# EAGLE design 507_outin_dragonboard (EAGLE 7.5.0)
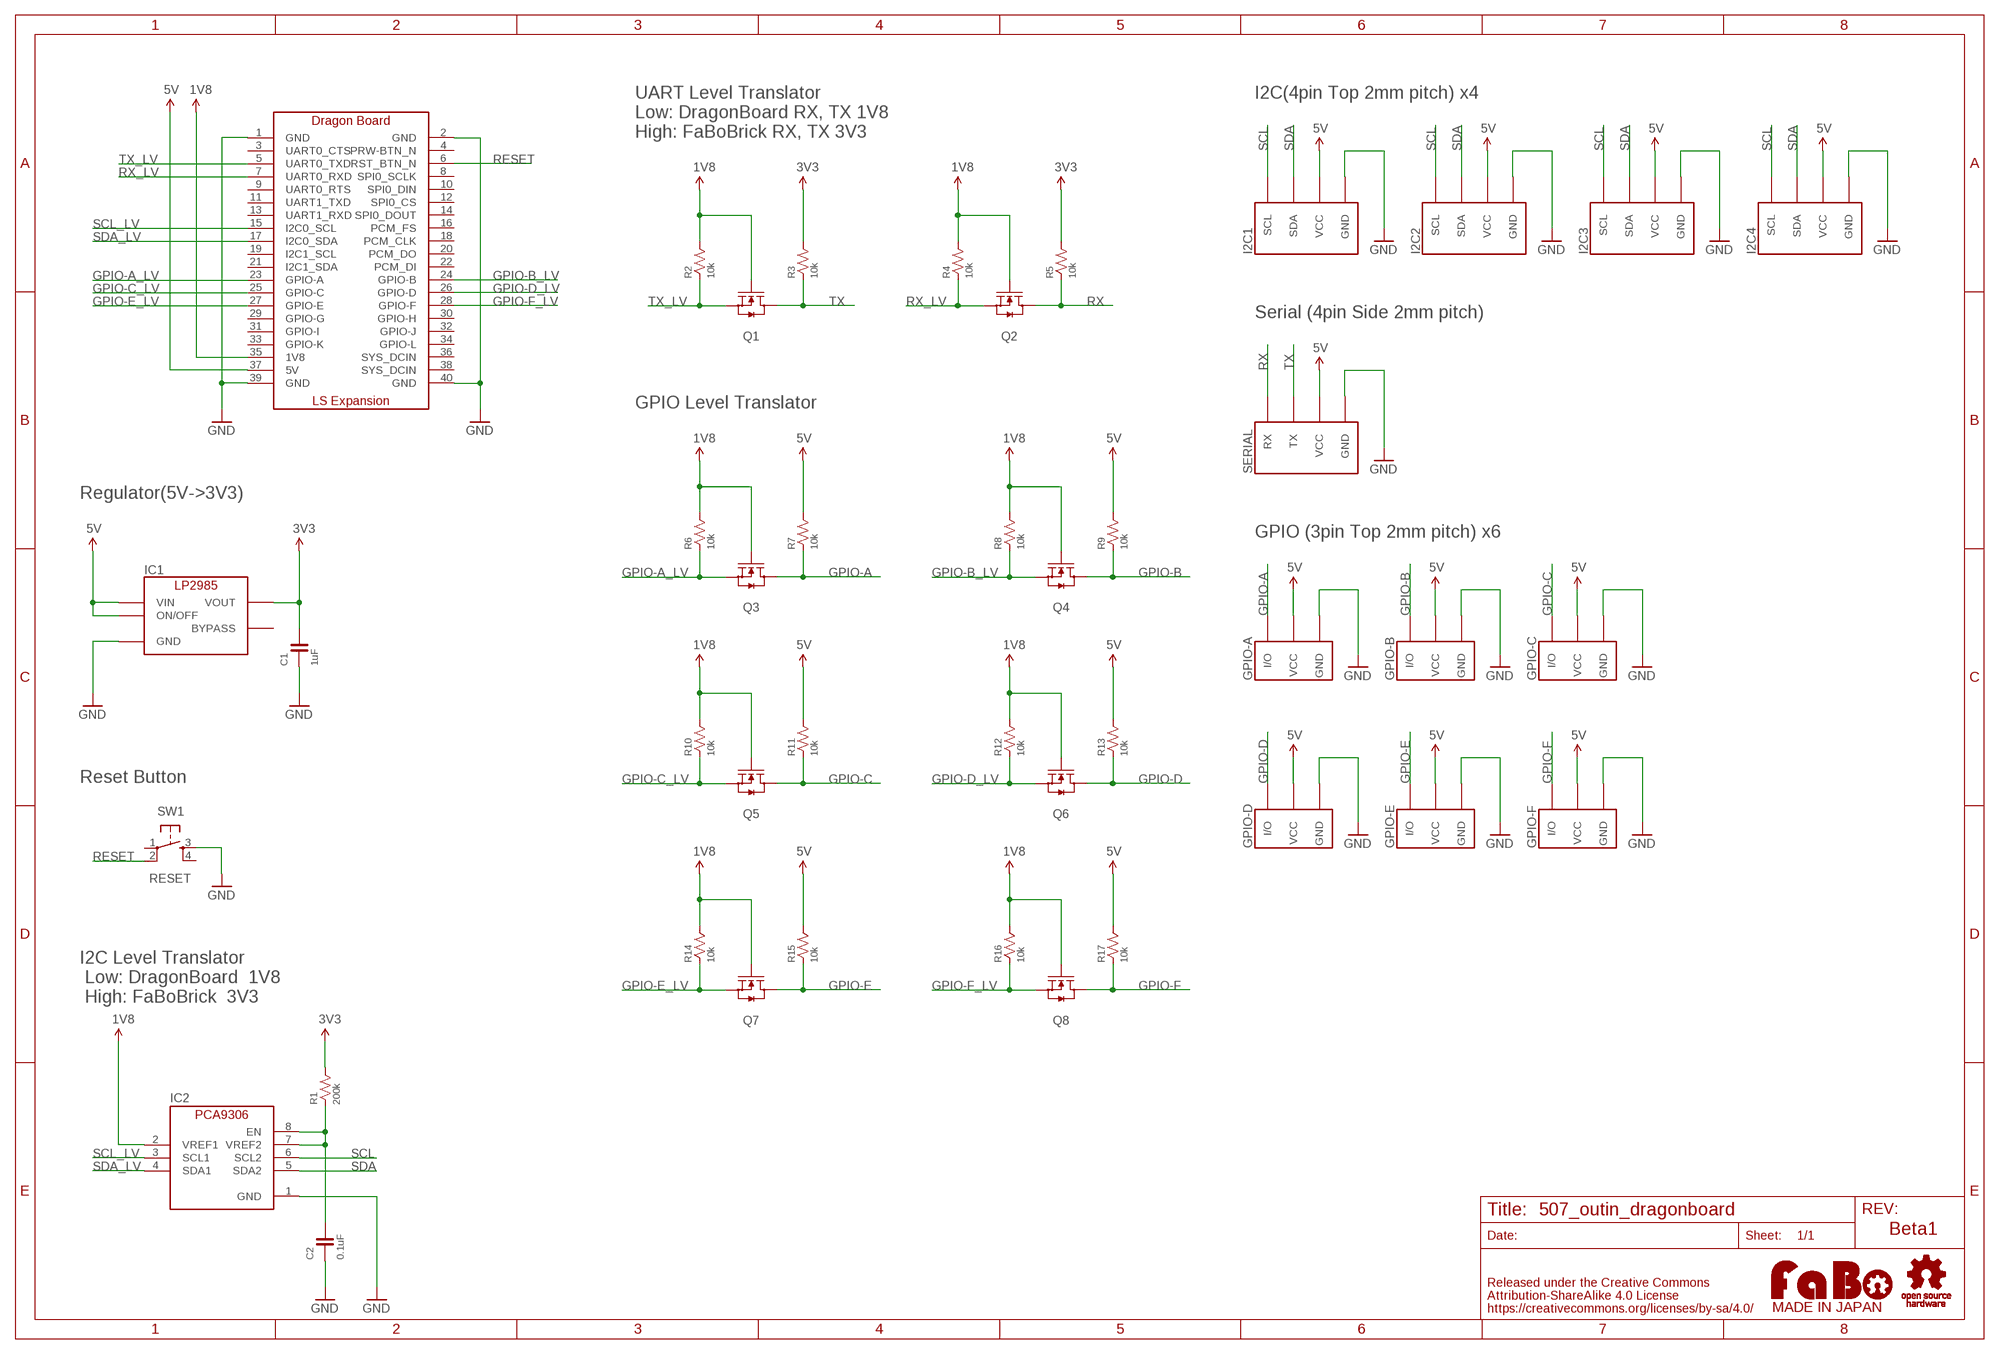
[diagram p0: schematic, sheet 1]

## Parts
C1  1uF  CAPACITOR-0603  [0603]
C2  0.1uF  CAPACITOR-0603  [0603]
GPIO-A  FABO_BRICK_3PIN-B03B-PASK-1  [FABO_BRICK_3PIN_B03B-PASK-1]
GPIO-B  FABO_BRICK_3PIN-B03B-PASK-1  [FABO_BRICK_3PIN_B03B-PASK-1]
GPIO-C  FABO_BRICK_3PIN-B03B-PASK-1  [FABO_BRICK_3PIN_B03B-PASK-1]
GPIO-D  FABO_BRICK_3PIN-B03B-PASK-1  [FABO_BRICK_3PIN_B03B-PASK-1]
GPIO-E  FABO_BRICK_3PIN-B03B-PASK-1  [FABO_BRICK_3PIN_B03B-PASK-1]
GPIO-F  FABO_BRICK_3PIN-B03B-PASK-1  [FABO_BRICK_3PIN_B03B-PASK-1]
I2C1  FABO_BRICK_I2C-B04B-PASK-1  [FABO_BRICK_I2C_B04B-PASK-1]
I2C2  FABO_BRICK_I2C-B04B-PASK-1  [FABO_BRICK_I2C_B04B-PASK-1]
I2C3  FABO_BRICK_I2C-B04B-PASK-1  [FABO_BRICK_I2C_B04B-PASK-1]
I2C4  FABO_BRICK_I2C-B04B-PASK-1  [FABO_BRICK_I2C_B04B-PASK-1]
IC1  TI-LP2985-33DBVR  [TI-LP2985]
IC2  TI-PCA9306DQE  [TI-PCA9306]
Q1  MOSFET-N-BSS138  [SOT23-3]
Q2  MOSFET-N-BSS138  [SOT23-3]
Q3  MOSFET-N-BSS138  [SOT23-3]
Q4  MOSFET-N-BSS138  [SOT23-3]
Q5  MOSFET-N-BSS138  [SOT23-3]
Q6  MOSFET-N-BSS138  [SOT23-3]
Q7  MOSFET-N-BSS138  [SOT23-3]
Q8  MOSFET-N-BSS138  [SOT23-3]
R1  200k  RESISTOR-0603  [0603]
R2  10k  RESISTOR-0603  [0603]
R3  10k  RESISTOR-0603  [0603]
R4  10k  RESISTOR-0603  [0603]
R5  10k  RESISTOR-0603  [0603]
R6  10k  RESISTOR-0603  [0603]
R7  10k  RESISTOR-0603  [0603]
R8  10k  RESISTOR-0603  [0603]
R9  10k  RESISTOR-0603  [0603]
R10  10k  RESISTOR-0603  [0603]
R11  10k  RESISTOR-0603  [0603]
R12  10k  RESISTOR-0603  [0603]
R13  10k  RESISTOR-0603  [0603]
R14  10k  RESISTOR-0603  [0603]
R15  10k  RESISTOR-0603  [0603]
R16  10k  RESISTOR-0603  [0603]
R17  10k  RESISTOR-0603  [0603]
SERIAL  FABO_BRICK_SERIAL-S04B-PASK-2  [FABO_BRICK_SERIAL_S04B-PASK-2]
SW1  RESET  SWITCH-TACT-6MM  [DTS_6_V]
U1  FABO-DRAGONBOARD  [FABO-DRAGONBOARD]
U$4  LOGO_OSHW-T_M_BOTTOM  [LOGO_OSHW_T_MS_BOTTOM]
U$8  LOGO_FABO-M  [LOGO_FABO_MS]

## Nets
1V8: IC2.2(VREF1) Q1.1(G) Q2.1(G) Q3.1(G) Q4.1(G) Q5.1(G) Q6.1(G) Q7.1(G) Q8.1(G) R2.2 R4.2 R6.2 R8.2 R10.2 R12.2 R14.2 R16.2 U1.35(1V8)
3V3: C1.2 IC1.5(VOUT) R1.2 R3.2 R5.2
5V: GPIO-A.VCC GPIO-B.VCC GPIO-C.VCC GPIO-D.VCC GPIO-E.VCC GPIO-F.VCC I2C1.VCC I2C2.VCC I2C3.VCC I2C4.VCC IC1.1(VIN) IC1.3(ON/OFF) R7.2 R9.2 R11.2 R13.2 R15.2 R17.2 SERIAL.VCC U1.37(5V)
GND: C1.1 C2.1 GPIO-A.GND GPIO-B.GND GPIO-C.GND GPIO-D.GND GPIO-E.GND GPIO-F.GND I2C1.GND I2C2.GND I2C3.GND I2C4.GND IC1.2(GND) IC2.1(GND) SERIAL.GND SW1.3 U1.1(GND) U1.2(GND) U1.39(GND) U1.40(GND)
GPIO-A: GPIO-A.I/O Q3.3(D) R7.1
GPIO-A_LV: Q3.2(S) R6.1 U1.23(GPIO-A)
GPIO-B: GPIO-B.I/O Q4.3(D) R9.1
GPIO-B_LV: Q4.2(S) R8.1 U1.24(GPIO-B)
GPIO-C: GPIO-C.I/O Q5.3(D) R11.1
GPIO-C_LV: Q5.2(S) R10.1 U1.25(GPIO-C)
GPIO-D: GPIO-D.I/O Q6.3(D) R13.1
GPIO-D_LV: Q6.2(S) R12.1 U1.26(GPIO-D)
GPIO-E: GPIO-E.I/O Q7.3(D) R15.1
GPIO-E_LV: Q7.2(S) R14.1 U1.27(GPIO-E)
GPIO-F: GPIO-F.I/O Q8.3(D) R17.1
GPIO-F_LV: Q8.2(S) R16.1 U1.28(GPIO-F)
N$1: C2.2 IC2.7(VREF2) IC2.8(EN) R1.1
RESET: SW1.2 U1.6(RST_BTN_N)
RX: Q2.3(D) R5.1 SERIAL.RX
RX_LV: Q2.2(S) R4.1 U1.7(UART0_RXD)
SCL: I2C1.SCL I2C2.SCL I2C3.SCL I2C4.SCL IC2.6(SCL2)
SCL_LV: IC2.3(SCL1) U1.15(I2C0_SCL)
SDA: I2C1.SDA I2C2.SDA I2C3.SDA I2C4.SDA IC2.5(SDA2)
SDA_LV: IC2.4(SDA1) U1.17(I2C0_SDA)
TX: Q1.3(D) R3.1 SERIAL.TX
TX_LV: Q1.2(S) R2.1 U1.5(UART0_TXD)
Unconnected: IC1.4(BYPASS) SW1.1 SW1.4 U1.3(UART0_CTS) U1.4(PRW-BTN_N) U1.8(SPI0_SCLK) U1.9(UART0_RTS) U1.10(SPI0_DIN) U1.11(UART1_TXD) U1.12(SPI0_CS) U1.13(UART1_RXD) U1.14(SPI0_DOUT) U1.16(PCM_FS) U1.18(PCM_CLK) U1.19(I2C1_SCL) U1.20(PCM_DO) U1.21(I2C1_SDA) U1.22(PCM_DI) U1.29(GPIO-G) U1.30(GPIO-H) U1.31(GPIO-I) U1.32(GPIO-J) U1.33(GPIO-K) U1.34(GPIO-L) U1.36(SYS_DCIN) U1.38(SYS_DCIN)

## Notes on the sheet
- I2C(4pin Top 2mm pitch) x4
- UART Level Translator
  Low: DragonBoard RX, TX 1V8
  High: FaBoBrick RX, TX 3V3
- Serial (4pin Side 2mm pitch)
- GPIO Level Translator
- Regulator(5V->3V3)
- GPIO (3pin Top 2mm pitch) x6
- Reset Button
- I2C Level Translator
   Low: DragonBoard  1V8
   High: FaBoBrick  3V3
- Beta1

## Library data of the parts
C1 C2 = FaBo-Capacitor:CAPACITOR: CAPACITOR
GPIO-A GPIO-B GPIO-C GPIO-D GPIO-E GPIO-F = FaBo-Template:FABO_BRICK_3PIN: FaBo Brick 3pin
I2C1-I2C4 = FaBo-Template:FABO_BRICK_I2C: FaBo Brick I2C
IC1 = FaBo-Supply:TI-LP2985: LP2985
IC2 = FaBo-LevelTranslator:TI-PCA9306
Q1-Q8 = FaBo-etc:MOSFET-N
R1-R17 = FaBo-Resistors:RESISTOR: RESISTOR
SERIAL = FaBo-Template:FABO_BRICK_SERIAL: FaBo Brick Serial
SW1 = FaBo-etc:SWITCH-TACT
U1 = FaBo-Template:FABO-DRAGONBOARD
U$4 = FaBo-etc:LOGO_OSHW
U$8 = FaBo-etc:LOGO_FABO

## Board
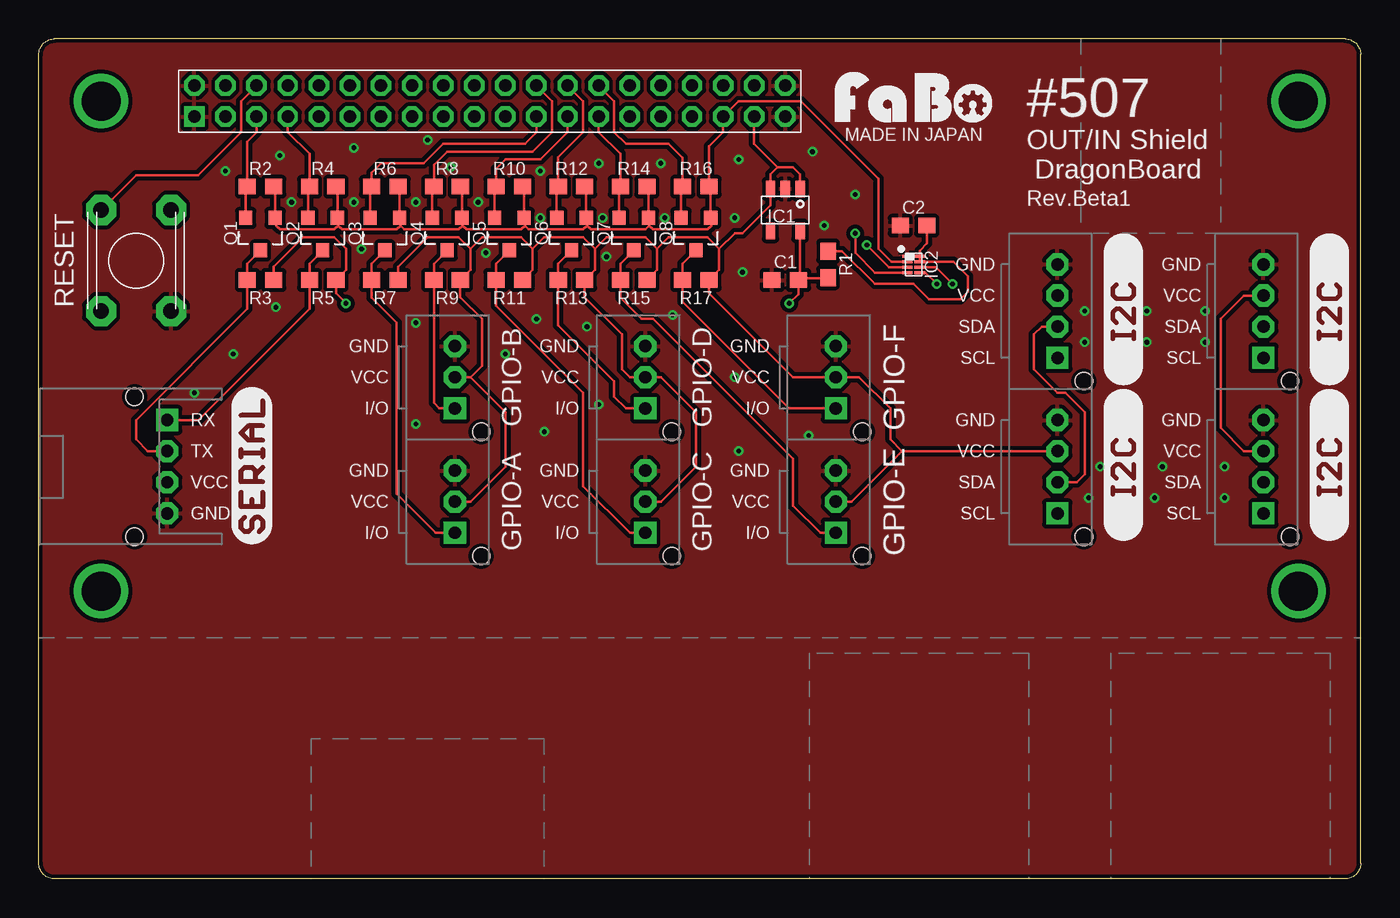
[diagram p1: board, top side]
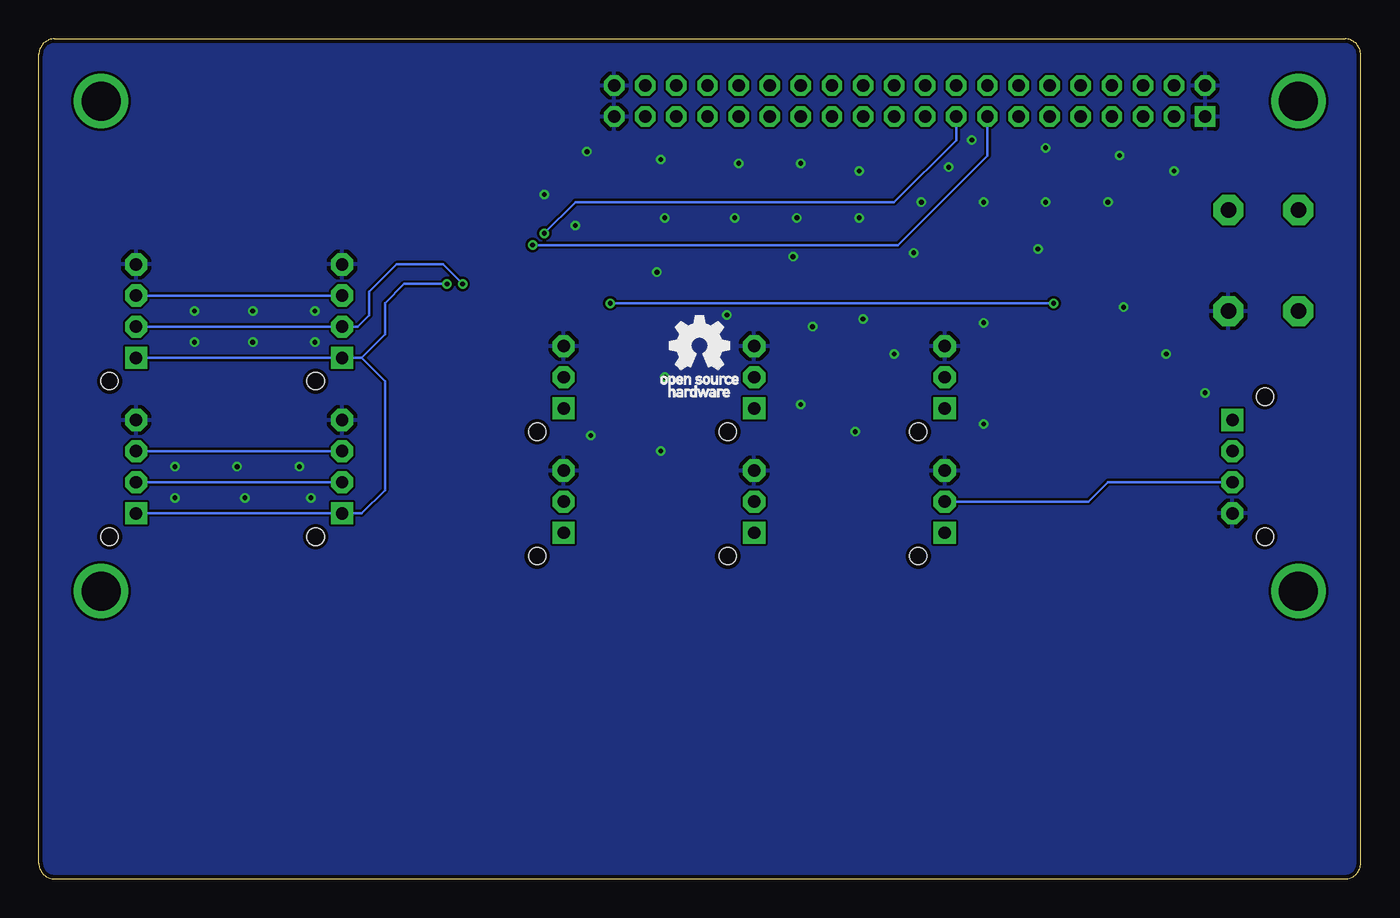
[diagram p2: board, bottom side, seen from below]

Size 85 x 54 mm. Coordinates in mm from the lower left corner, seen from the top.
Copper layers (1*16): Top 0.035mm / dielectric 1.5mm / Bottom 0.035mm
Design rules "Elecrow_2-layer_eagle_rule": minimum track width 6mil, minimum drill 12mil, track to track 6mil, track to pad 6mil, pad to pad 6mil, via to via 6mil, smd to smd 0mil, copper to edge 10mil, drill to drill 10mil, minimum pad ring 10mil, minimum via ring 6mil, stop-mask expansion 2mil, vias tented up to drill 100mil, thermal gap 10mil

### Footprints (pad centres in the part's own frame; a part is rotated, then mirrored left to right if it is on the bottom)
0603 = smd 1.1 x 1: 1 -0.85,0; 2 0.85,0
FABO_BRICK_3PIN_B03B-PASK-1 = drill 0.8 pad 1.422 octagon: GND -2,0; VCC 0,0 | drill 0.8 pad 1.422 square: I/O 2,0 | hole 1.1: 3.5,1.7
FABO_BRICK_I2C_B04B-PASK-1 = drill 0.8 pad 1.422 octagon: GND -3,0; SDA 1,0; VCC -1,0 | drill 0.8 pad 1.422 square: SCL 3,0 | hole 1.1: 4.5,1.7
TI-LP2985 = smd 0.6 x 1.05: 1 -0.95,-1.35; 2 0,-1.35; 3 0.95,-1.35; 4 0.95,1.35; 5 -0.95,1.35
TI-PCA9306 = smd 0.2 x 0.65: 1 -0.525,-0.395; 2 -0.175,-0.395; 3 0.175,-0.395; 4 0.525,-0.395; 5 0.525,0.395; 6 0.175,0.395; 7 -0.175,0.395; 8 -0.525,0.395
SOT23-3 = smd 0.85 x 0.9: 1 -0.95,-1; 2 0.95,-1; 3 0,1.1
FABO_BRICK_SERIAL_S04B-PASK-2 = drill 0.8 pad 1.422 octagon: GND -3,0; TX 1,0; VCC -1,0 | drill 0.8 pad 1.422 square: RX 3,0 | hole 1.1: 4.5,2.1; -4.5,2.1
DTS_6_V = drill 1 pad 1.93 octagon: 1 -3.25,2.25; 2 3.25,2.25; 3 -3.25,-2.25; 4 3.25,-2.25
FABO-DRAGONBOARD = drill 0.8 pad 1.27 square: 1 10,49 | drill 0.8 pad 1.27 octagon: 2 10,51; 3 12,49; 4 12,51; 5 14,49; 6 14,51; 7 16,49; 8 16,51; 9 18,49; 10 18,51; 11 20,49; 12 20,51; 13 22,49; 14 22,51; 15 24,49; 16 24,51; 17 26,49; 18 26,51; 19 28,49; 20 28,51; 21 30,49; 22 30,51; 23 32,49; 24 32,51; 25 34,49; 26 34,51; 27 36,49; 28 36,51; 29 38,49; 30 38,51; 31 40,49; 32 40,51; 33 42,49; 34 42,51; 35 44,49; 36 44,51; 37 46,49; 38 46,51; 39 48,49; 40 48,51 | drill 2.5 pad 3.2: PAD1 4,18.5; PAD2 4,50; PAD3 81,50; PAD4 81,18.5

### Placement (x,y rotation side)
C1  48,38.5 0 top
C2  56.25,42 0 top
GPIO-A  26.75,24.25 270 top
GPIO-B  26.75,32.25 270 top
GPIO-C  39,24.25 270 top
GPIO-D  39,32.25 270 top
GPIO-E  51.25,24.25 270 top
GPIO-F  51.25,32.25 270 top
I2C1  78.75,26.5 270 top
I2C2  78.75,36.5 270 top
I2C3  65.5,26.5 270 top
I2C4  65.5,36.5 270 top
IC1  48,43 180 top
IC2  56.25,39.5 270 top
Q1  14.25,41.5 180 top
Q2  18.25,41.5 180 top
Q3  22.25,41.5 180 top
Q4  26.25,41.5 180 top
Q5  30.25,41.5 180 top
Q6  34.25,41.5 180 top
Q7  38.25,41.5 180 top
Q8  42.25,41.5 180 top
R1  50.75,39.5 270 top
R2  14.25,44.5 0 top
R3  14.25,38.5 0 top
R4  18.25,44.5 0 top
R5  18.25,38.5 0 top
R6  22.25,44.5 0 top
R7  22.25,38.5 0 top
R8  26.25,44.5 0 top
R9  26.25,38.5 0 top
R10  30.25,44.5 0 top
R11  30.25,38.5 0 top
R12  34.25,44.5 0 top
R13  34.25,38.5 0 top
R14  38.25,44.5 0 top
R15  38.25,38.5 0 top
R16  42.25,44.5 0 top
R17  42.25,38.5 0 top
SERIAL  8.25,26.5 90 top
SW1  6.25,39.75 90 top
U1  0,0 0 top
U$2  [LOGO_SILK_I2C]  71,21.75 90 top
U$3  [LOGO_SILK_SERIAL2]  15,21.5 90 top
U$4  42.5,34.25 0 top
U$5  [LOGO_SILK_I2C]  84.25,31.75 90 top
U$6  [LOGO_SILK_I2C]  71,31.75 90 top
U$7  [LOGO_SILK_I2C]  84.25,21.75 90 top
U$8  56.25,48.25 0 top

### Tracks (layer width: path | path; a pad name or v marks a point on that pad's centre or on a via)
1V8
  Top 0.152: R2.2 15.2,44.4 Q1.1 15.2,42.3 15.25,42.25 15.25,42 15.5,41.75 19,41.75 19.25,42 | Q2.1 19.2,44.4 R4.2 | Q3.1 23.2,44.4 R6.2 | Q4.1 27.2,44.4 R8.2 | Q5.1 31.2,44.4 R10.2 | Q6.1 35.2,44.4 R12.2 | Q7.1 39.2,44.4 R14.2 | 19.25,42.25 19.25,42.45 Q2.1 | Q2.1 19.2,42.3 19.25,42.25 | 19.25,42.25 19.25,42 | 19.25,42 19.5,41.75 23,41.75 23.25,42 | 23.25,42.25 23.25,42.45 Q3.1 | Q3.1 23.2,42.3 23.25,42.25 | 23.25,42.25 23.25,42 | 23.25,42 23.5,41.75 27,41.75 27.25,42 | 27.25,42.25 27.25,42.45 Q4.1 | Q4.1 27.2,42.3 27.25,42.25 | 27.25,42.25 27.25,42 | 27.25,42 27.5,41.75 31,41.75 31.25,42 | 31.25,42.25 31.25,42.45 Q5.1 | Q5.1 31.2,42.3 31.25,42.25 | 31.25,42.25 31.25,42 | 31.25,42 31.5,41.75 35,41.75 35.25,42 | 35.25,42.25 35.25,42.45 Q6.1 | Q6.1 35.2,42.3 35.25,42.25 | 35.25,42.25 35.25,42 | 35.25,42 35.5,41.75 39,41.75 39.25,42 | 39.25,42.25 39.25,42.45 Q7.1 | Q7.1 39.2,42.3 39.25,42.25 | 39.25,42.25 39.25,42 | 39.25,42 39.5,41.75 43,41.75 43.25,42 43.25,42.45 Q8.1 43.2,44.4 R16.2 43.1,47.1 44,48 U1.35 45,50 49,50 54,45 54,40.5 54.83,39.67 IC2.2
3V3  (via drill 0.3)
  Top 0.152: R3.2 15.1,39.35 17,41.25 19,41.25 19.75,40.5 19.75,39.15 R5.2 19.1,37.65 v19.75,37 | IC1.5 48.95,38.6 | 48.95,38.6 C1.2 48.85,37.6 v48.25,37 | 48.95,38.6 50.45,38.6 R1.2
  Bottom 0.152: v48.25,37 v19.75,37
5V
  Top 0.152: IC1.1 48.95,45.3 48.5,45.75 47.5,45.75 | 47.5,45.75 47.05,45.3 IC1.3 47.05,43.3 45.25,41.5 44.75,41.5 43.75,40.5 | 47.5,45.75 46,47.25 U1.37 | R7.2 23.1,39.35 25,41.25 27,41.25 27.75,40.5 | 27.75,40.5 27.75,39.15 R9.2 27.1,37.4 28.5,36 28.5,33 27.75,32.25 | 27.75,40.5 28.5,41.25 31,41.25 31.75,40.5 | R11.2 31.75,39.15 31.75,40.5 | 31.75,40.5 32.5,41.25 35,41.25 35.75,40.5 | 35.75,40.5 35.75,39.15 R13.2 35.1,37.4 37.5,35 37.5,32.75 38,32.25 GPIO-D.VCC 40,32.25 42.25,30 42.25,26.5 40,24.25 GPIO-C.VCC | 35.75,40.5 36.5,41.25 39,41.25 39.75,40.5 | R15.2 39.75,39.15 39.75,40.5 | 39.75,40.5 40.5,41.25 43,41.25 43.75,40.5 | 43.75,40.5 43.75,39.15 R17.2 43.1,37.65 48.5,32.25 GPIO-F.VCC 52.75,32.25 54.75,30.25 54.75,28.25 55.5,27.5 | GPIO-B.VCC 27.75,32.25 | 27.75,32.25 30,30 30,26.5 27.75,24.25 GPIO-A.VCC | 55.5,27.5 52.25,24.25 GPIO-E.VCC | I2C3.VCC 55.5,27.5 | I2C1.VCC 77.5,27.5 76,29 76,36 77.5,37.5 I2C2.VCC
  Bottom 0.152: SERIAL.VCC 16.25,25.5 17.5,24.25 GPIO-A.VCC | I2C3.VCC I2C1.VCC | I2C4.VCC I2C2.VCC
GND  (via drill 0.3)
  other vias: 45,46.25 49.75,46.75 44.75,42.5 50.5,42 52.5,44 45.25,39 40,46 36,46 25,47.5 26.5,45.75 28.25,43.5 32.25,42.5 40.25,42.5 36.25,42.5 32.25,45.5 20.25,47 24.25,43.5 20.25,43.5 15.5,46.5 12,45.5 16.25,43.5 15.25,36.75 10,31.25 12.5,33.75 49.5,28.5 44.75,32.25 40.75,36.25 24.25,35.75 24.25,29.25 32,36 35.25,35.5 36,30.5 71.25,36.5 71.25,34.5 67.25,36.5 67.25,34.5 75,36.5 75,34.5 68.25,26.5 67.5,24.5 71.75,24.5 72.25,26.5 76.25,26.5 76.25,24.5 28.75,40.25 36.5,40 20.75,40.5 30,33.75 32.5,28.75 45,27.5
  pour Bottom: -0.52,-0.52 85.5,-0.5 85.5,54.5 -0.5,54.5
  pour Top (isolate 0.254): -0.52,-0.52 85.5,-0.5 85.5,54.5 -0.5,54.5
GPIO-A
  Top 0.152: Q3.3 21.4,39.55 R7.1 21.4,37.35 23,35.75 23,24.75 25.5,22.25 GPIO-A.I/O
GPIO-A_LV
  Top 0.152: U1.23 32,48 31.25,47.25 26,47.25 24.75,46 22,46 21.4,45.4 R6.1 21.3,44.4 Q3.2
GPIO-B
  Top 0.152: Q4.3 25.4,39.55 R9.1 25.4,30.6 25.75,30.25 GPIO-B.I/O
GPIO-B_LV
  Top 0.152: U1.24 33,50 33,48 31.75,46.75 26.25,46.75 25.4,45.9 R8.1 25.3,44.4 Q4.2
GPIO-C
  Top 0.152: Q5.3 29.4,39.55 R11.1 29.4,36.85 35,31.25 35,25.25 38,22.25 GPIO-C.I/O
GPIO-C_LV
  Top 0.152: U1.25 34,48 32.25,46.25 30,46.25 29.4,45.65 R10.1 29.3,44.4 Q5.2
GPIO-D
  Top 0.152: Q6.3 33.4,39.55 R13.1 33.4,35.6 37,32 37,31 37.75,30.25 GPIO-D.I/O
GPIO-D_LV
  Top 0.152: U1.26 35,50 35,48 33.4,46.4 R12.1 33.3,44.4 Q6.2
GPIO-E
  Top 0.152: Q7.3 37.4,39.55 R15.1 37.4,37.35 38.75,36 39.5,36 48.5,27 48.5,24 50.25,22.25 GPIO-E.I/O
GPIO-E_LV
  Top 0.152: U1.27 36,48 37.4,46.6 R14.1 37.3,44.4 Q7.2
GPIO-F
  Top 0.152: Q8.3 41.4,39.55 R17.1 41.4,37.1 48.25,30.25 GPIO-F.I/O
GPIO-F_LV
  Top 0.152: U1.28 37,50 37,48 37.75,47.25 40.5,47.25 41.4,46.35 R16.1 41.3,44.4 Q8.2
N$1
  Top 0.152: C2.2 57.1,40.85 56.65,40.4 IC2.8 IC2.7 58.83,39.67 59.75,38.75 59.75,37.75 59.25,37.25 57.25,37.25 56.25,38.25 53.75,38.25 51.65,40.35 R1.1
RESET
  Top 0.152: U1.6 13,50 13,48 10.25,45.25 6.25,45.25 SW1.2
RX
  Top 0.152: Q2.3 17.4,39.55 R5.1 17.4,36.65 10.25,29.5 SERIAL.RX
RX_LV
  Top 0.152: U1.7 16,48 17.4,46.6 R4.1 17.3,44.4 Q2.2
SCL  (via drill 0.3)
  Top 0.152: IC2.6 57.67,39.33 v58.75,38.25
  Bottom 0.152: 64.25,33.5 I2C4.SCL I2C2.SCL 65,33.5 | 64.25,33.5 62.75,35 62.75,37 61.5,38.25 v58.75,38.25 | I2C1.SCL I2C3.SCL 64.25,23.5 62.75,25 62.75,32 64.25,33.5
SCL_LV  (via drill 0.3)
  Top 0.152: v53.25,40.75 54.67,39.33 IC2.3
  Bottom 0.152: U1.15 24,46.5 29.75,40.75 v53.25,40.75
SDA  (via drill 0.3)
  Top 0.152: IC2.5 57.02,38.98 v57.75,38.25 | I2C4.SDA 64.5,35.5 64,35 64,32.75 65.5,31.25 66,31.25 67.25,30 67.25,26 66.75,25.5 I2C3.SDA
  Bottom 0.152: v57.75,38.25 59,39.5 62,39.5 63.75,37.75 63.75,36.25 64.5,35.5 I2C4.SDA I2C2.SDA | I2C1.SDA I2C3.SDA
SDA_LV  (via drill 0.3)
  Top 0.152: v52.5,41.5 52.5,40.25 53.77,38.98 IC2.4
  Bottom 0.152: U1.17 26,47.5 30,43.5 50.5,43.5 v52.5,41.5
TX
  Top 0.152: Q1.3 13.4,39.55 R3.1 13.4,36.65 6.25,29.5 6.25,28.25 7,27.5 SERIAL.TX
TX_LV
  Top 0.152: U1.5 14,48 13.4,47.4 R2.1 13.3,44.4 Q1.2

### Text on the board
tPlace: #507 | MADE IN JAPAN | OUT/IN Shield / DragonBoard | Rev.Beta1 | RESET | GND | GND | VCC | VCC | SDA | SDA | GND | GND | GND | SCL | SCL | VCC | VCC | VCC | RX | I/O | I/O | I/O | GND | GND | TX | VCC | VCC | VCC | GND | GND | GND | SDA | SDA | GND | VCC | VCC | VCC | SCL | SCL | I/O | I/O | I/O
tDocu: DCJACK | Display | USB Host2 | USB Host1